# Altium schematic sheet Terminators.SchDoc
size A4; Organization: Altium Limited; Address1: 3 Minna Close; Address2: Belrose; Address3: NSW 2085; Address4: Australia
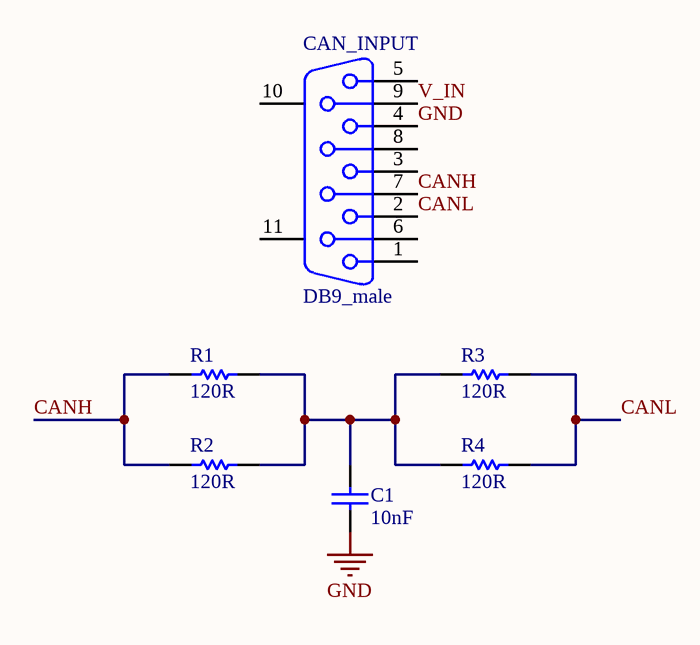
[diagram p0: Terminators.SchDoc]

## Parts
C1  10nF  [CC0603]
CAN_INPUT  DB9_male  [db9_male]
R1  120R  [R0603]
R2  120R  [R0603]
R3  120R  [R0603]
R4  120R  [R0603]

## Nets
GND: C1.1 CAN_INPUT.4
CANH: CAN_INPUT.7 R1.1 R2.1
CANL: CAN_INPUT.2 R3.2 R4.2
V_IN: CAN_INPUT.9
NetC1_2: C1.2 R1.2 R2.2 R3.1 R4.1

Not connected (* = marked no-connect by the designer): CAN_INPUT 1 3 5 6 8 10(MH1) 11(MH2)

## Notes on the sheet
- Title
- Size:
- Date:
- A4
- Number:
- Time:
- Revision:
- Sheet
- of
- File:

## Library data of the parts
C1 = 10nF_CC0603: 0603 Capacitor; Supplier_Component_Code: RC-P097; published: 28/03/2007 10:54:57 a.m.; Supplier_Name: Soanar Plus; price: 0.09; value: 10nF; Part Number: 10nF_CC0603; Component Kind: Standard; Component Type: Standard; Designator: 10nF_CC0603; Pin Count: 2
CAN_INPUT = db9_male: DB9 Male Connecter; ECE_Component_Code: db9_male; Supplier_Component_Code: PP-0770; published: 27/09/2006; Supplier_Name: Soanar Plus; price: 1.5; value: DB9_male; Part Number: db9_male; Component Kind: Standard; Component Type: Standard; Designator: db9_male; Pin Count: 11
R1-R4 = 120R_R0603: 0603 Resistor; ECE_Component_Code: 120R_R0603; value: 120R; Supplier_Component_Code: RS-S051; published: 12/03/2007 11:34:34 a.m.; Supplier_Name: Soanar Plus; price: 0.08; Part Number: 120R_R0603; Component Kind: Standard; Component Type: Standard; Designator: 120R_R0603; Pin Count: 2